# EAGLE schematic Wheelspeed rev11_v2 (EAGLE 9.6.2)
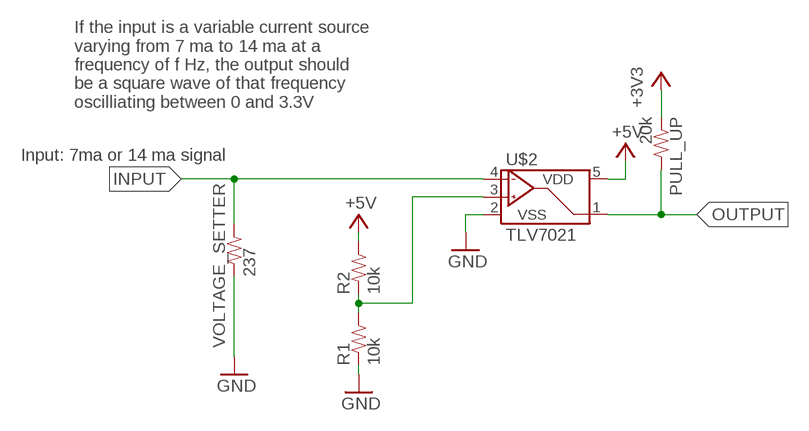
[diagram p0: schematic, sheet 1]

## Parts
PULL_UP  20k  RESISTOR0603  [0603-RES]
R1  10k  RESISTOR0603  [0603-RES]
R2  10k  RESISTOR0603  [0603-RES]
U$2  TLV7021  OPA990IDBVR  [SOT-23-5]
VOLTAGE_SETTER  237  RESISTOR0603  [0603-RES]

## Nets
+3V3: PULL_UP.1
+5V: R2.2 U$2.5(VDD)
GND: R1.1 U$2.2(VSS) VOLTAGE_SETTER.1
INPUT: U$2.4(VIN-) VOLTAGE_SETTER.2
N$1: R1.2 R2.1 U$2.3(VIN+)
OUTPUT: PULL_UP.2 U$2.1(VOUT)

## Notes on the sheet
- If the input is a variable current source
  varying from 7 ma to 14 ma at a
  frequency of f Hz, the output should
  be a square wave of that frequency
  oscilliating between 0 and 3.3V
- Input: 7ma or 14 ma signal

## Library data of the parts
PULL_UP R1 R2 VOLTAGE_SETTER = HyTechDevices:RESISTOR: Resistor Basic schematic elements and footprints for 0603, 1206, and PTH resistors.
U$2 = HyTechDevices:OPA990IDBVR: TI OPA990 20V Op-Amp Comparator Datasheet <https://www.ti.com/lit/ds/symlink/opa990.pdf>